# EasyEDA schematic SCH_Robot-car-chihuahua-v1_2024-11-28.json

## Sheets
1 Sheet_1: TITLE: Motor Control Board; REV: 1.0; Date: 2024-11-23; Sheet: 1/1; Drawn By: goobertrooper69; Company: Team NULL
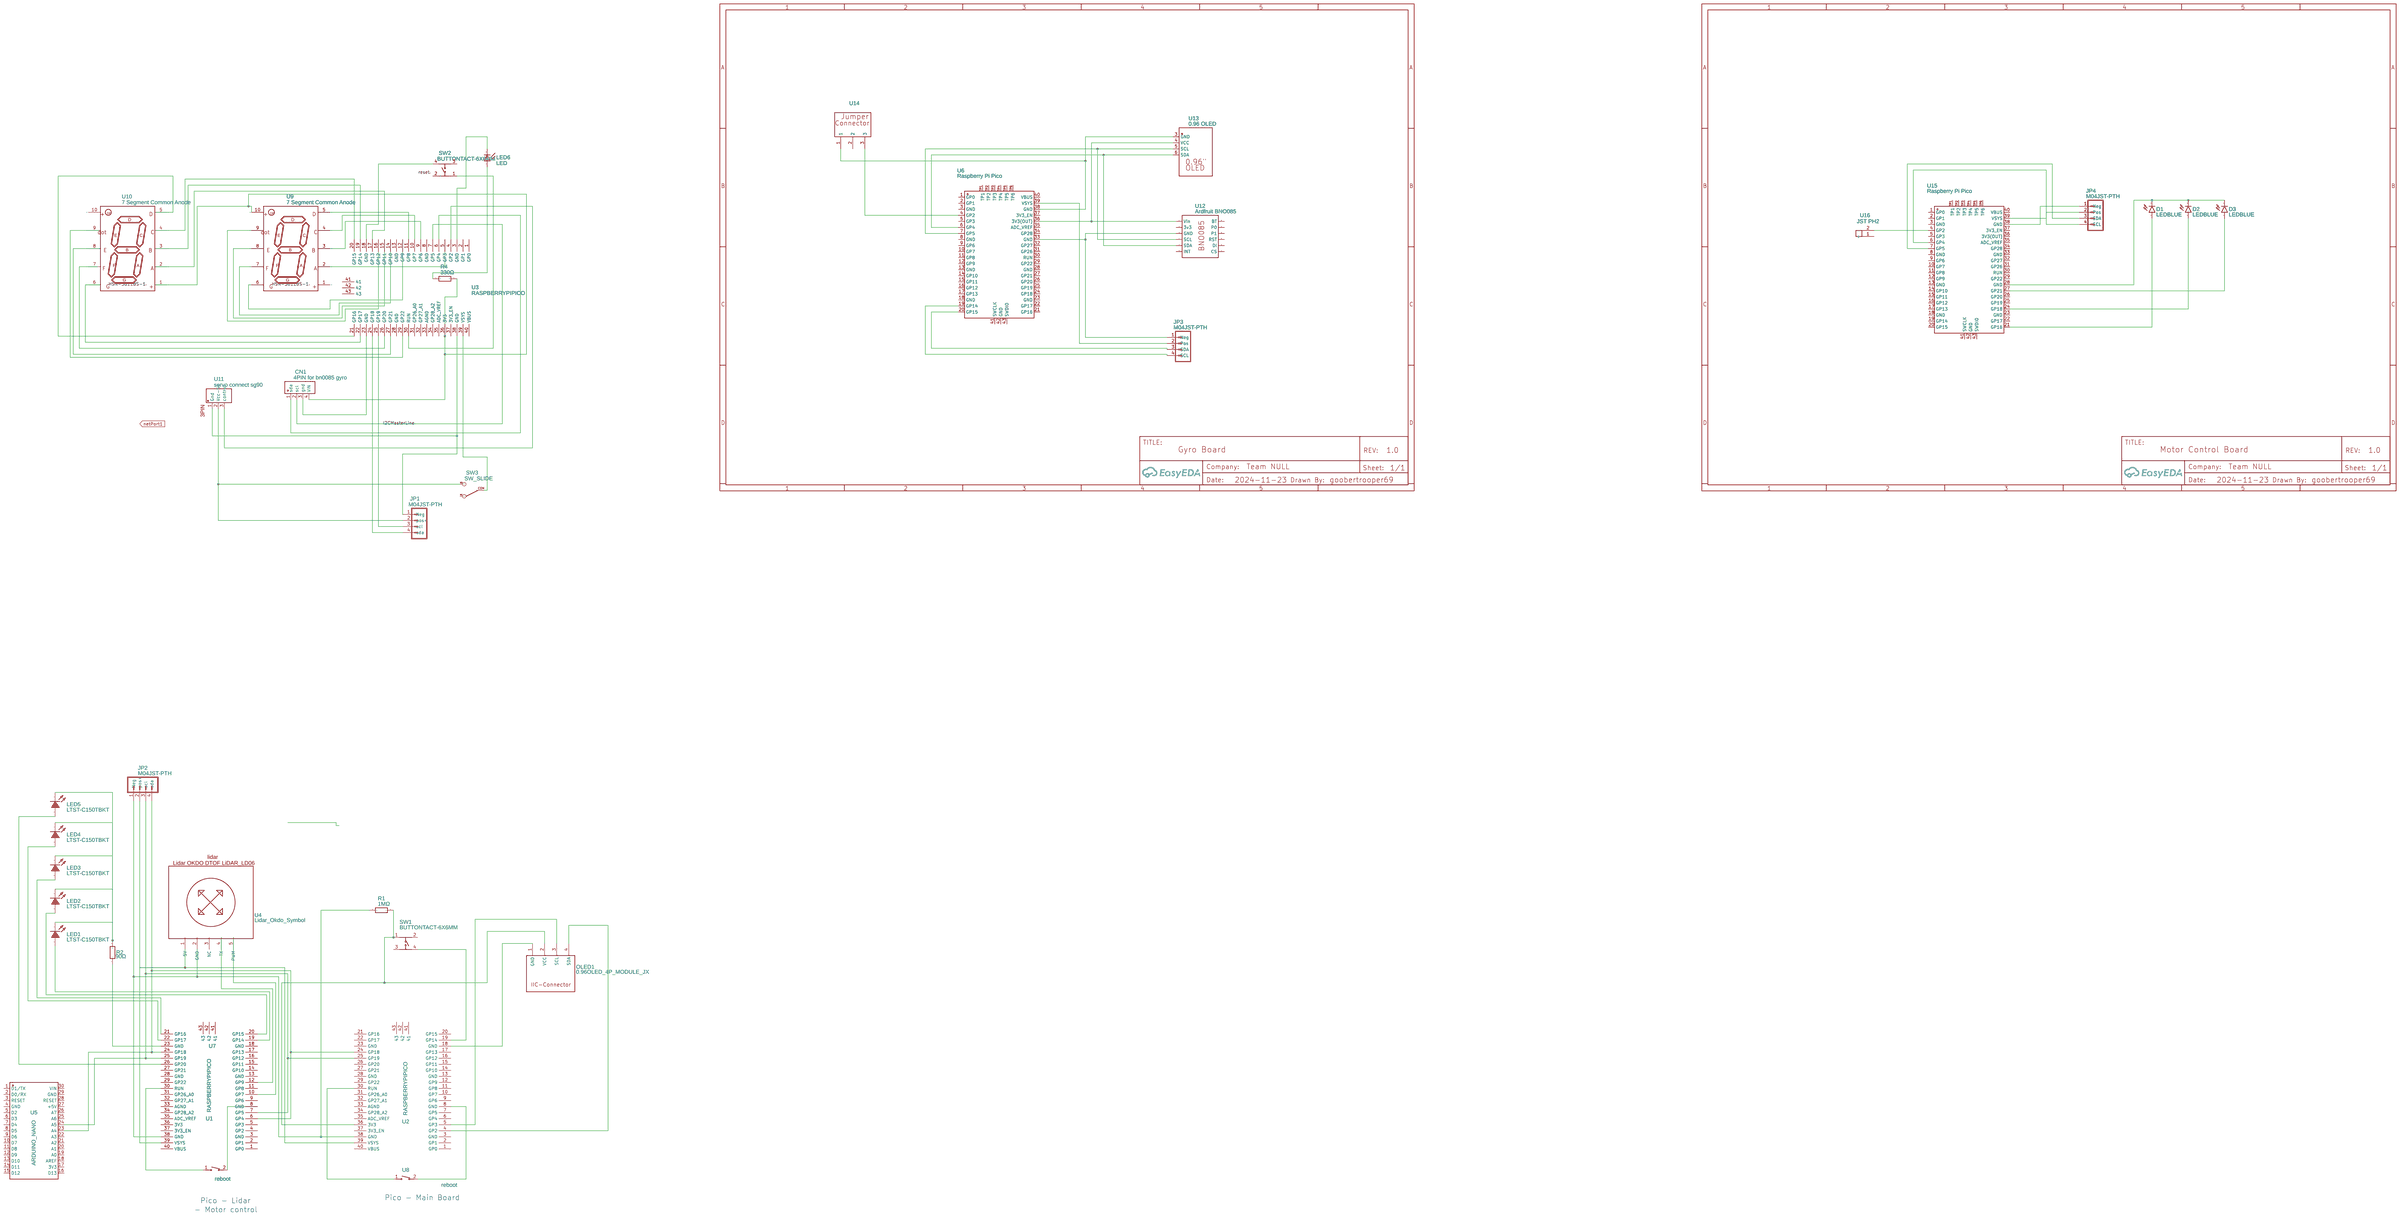
[diagram p0: Sheet_1]
2 Gyro Board: TITLE: Gyro Board; Drawn By: Team NULL
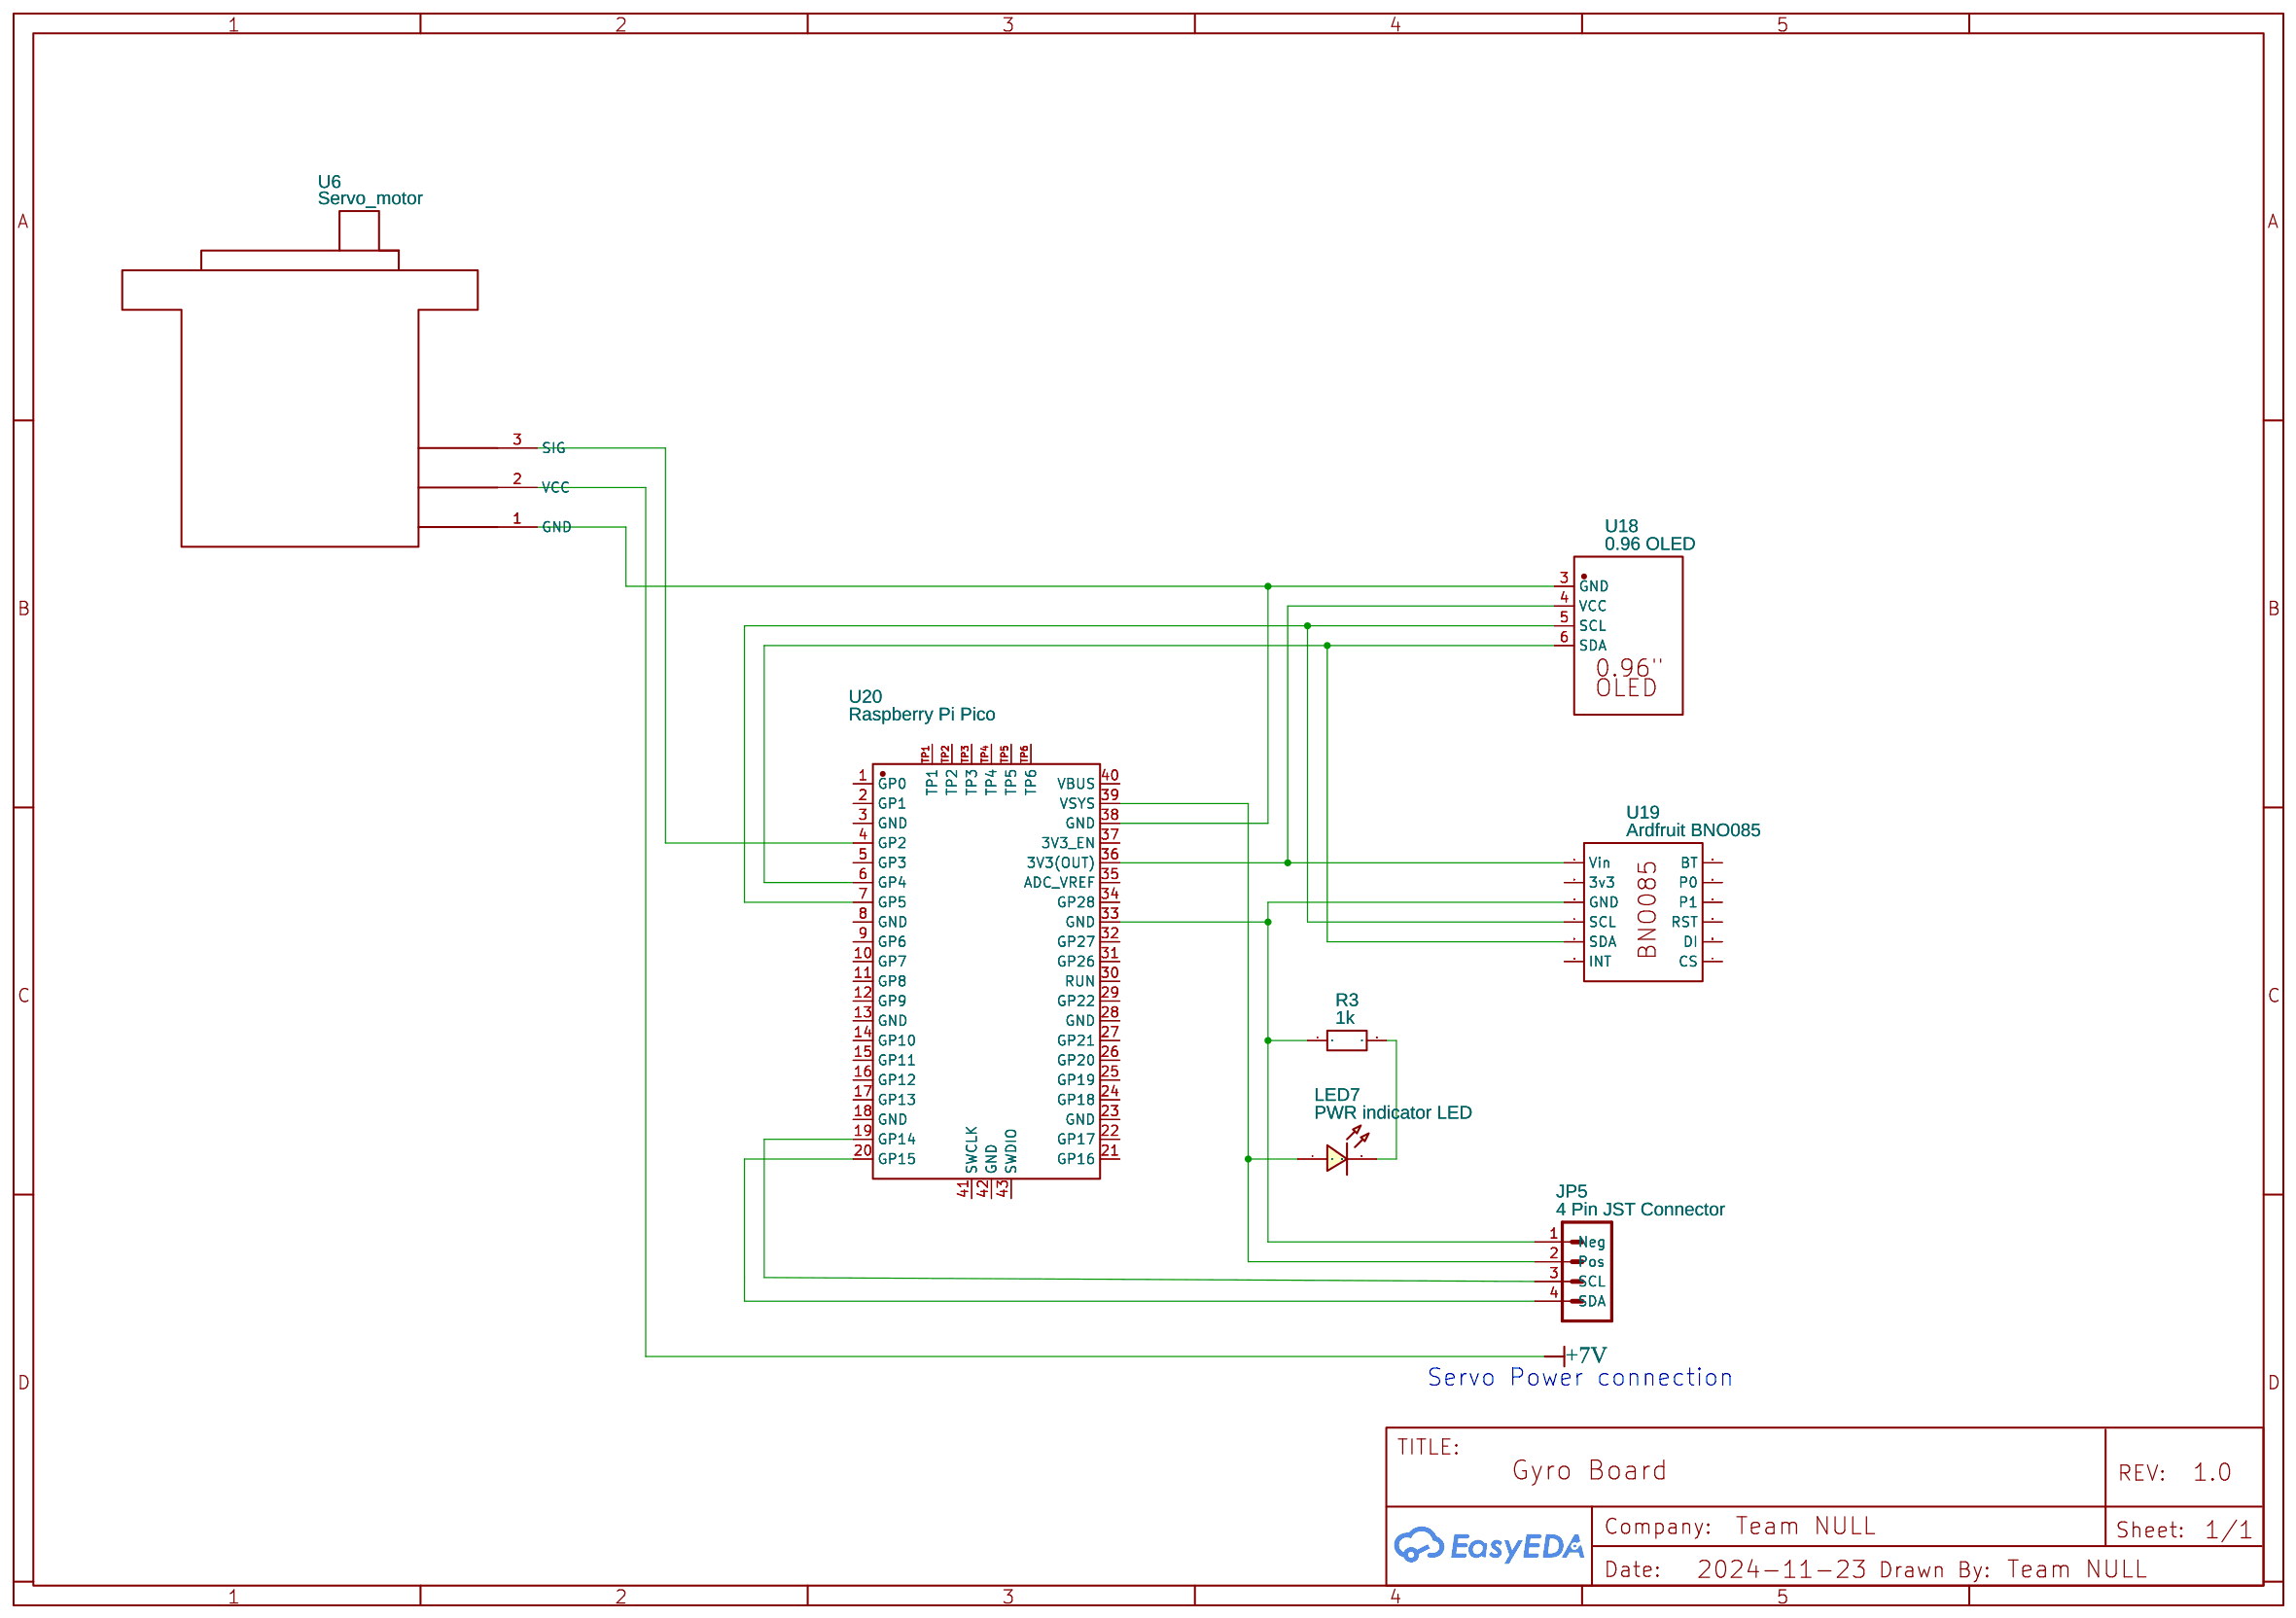
[diagram p1: Gyro Board]
3 Motor Board: TITLE: Motor Board; Drawn By: Team NULL
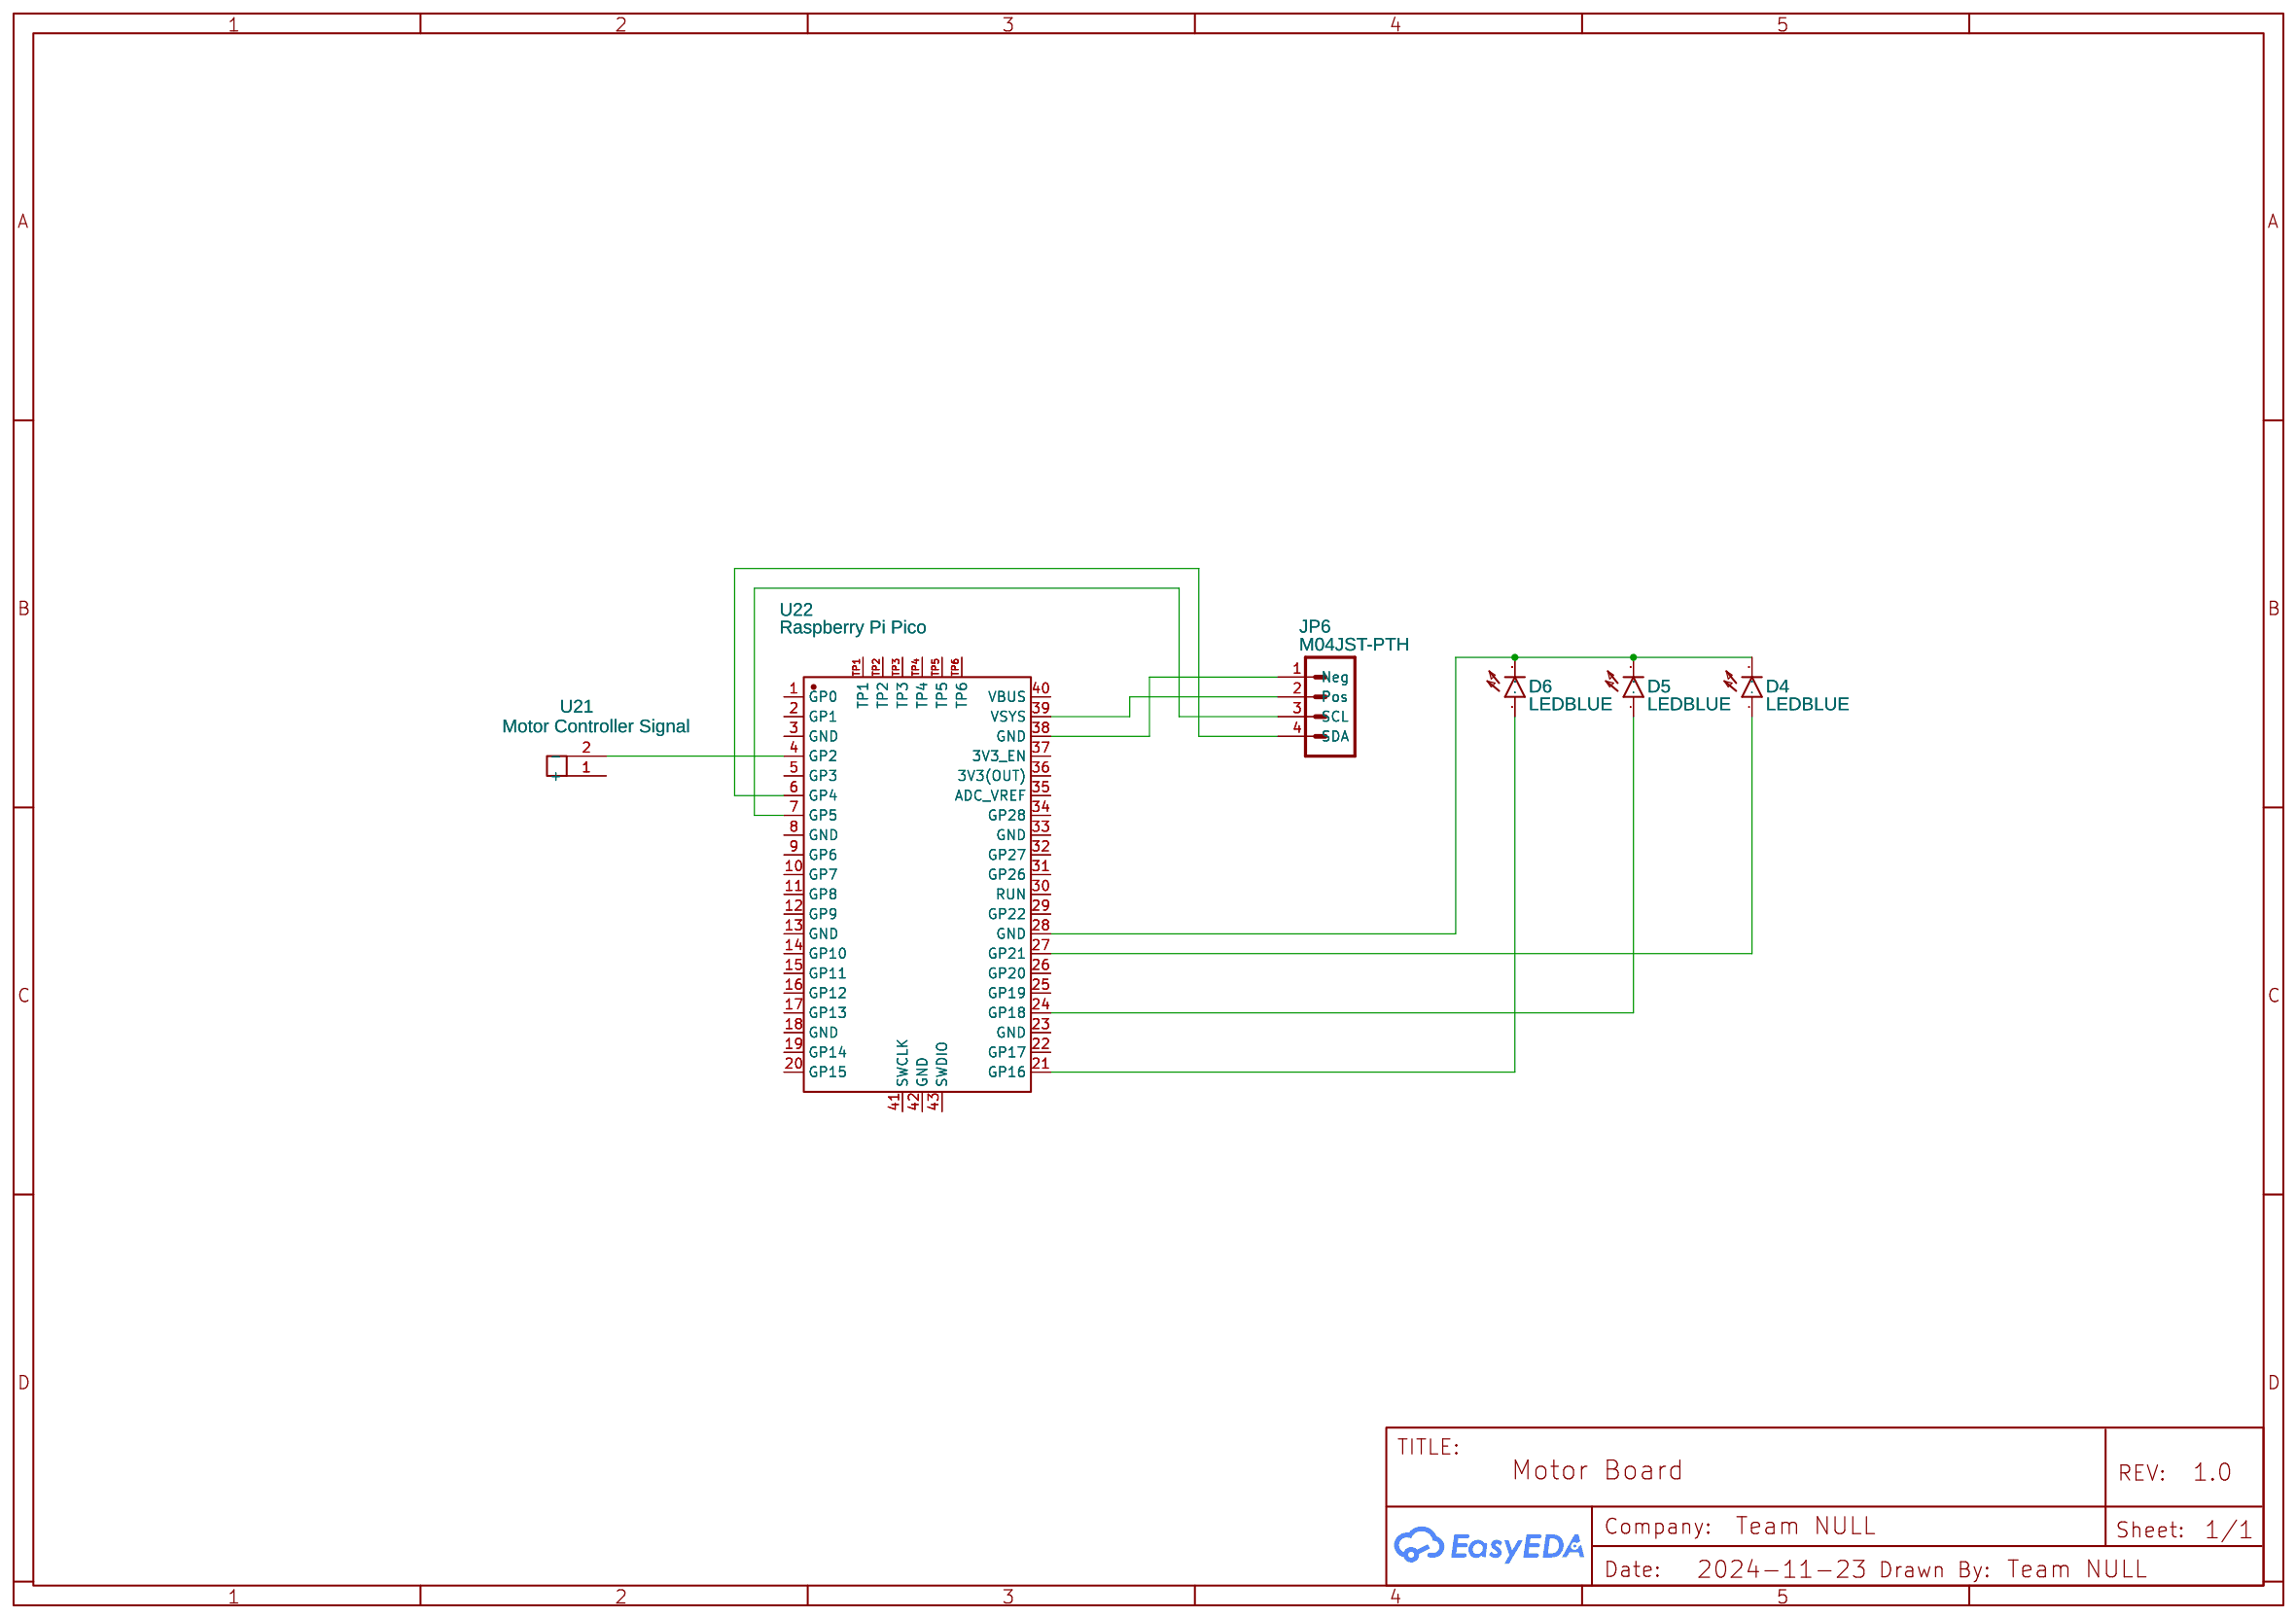
[diagram p2: Motor Board]
4 Main Board: TITLE: Main Board; Drawn By: Team NULL; Company: TEAM NULL
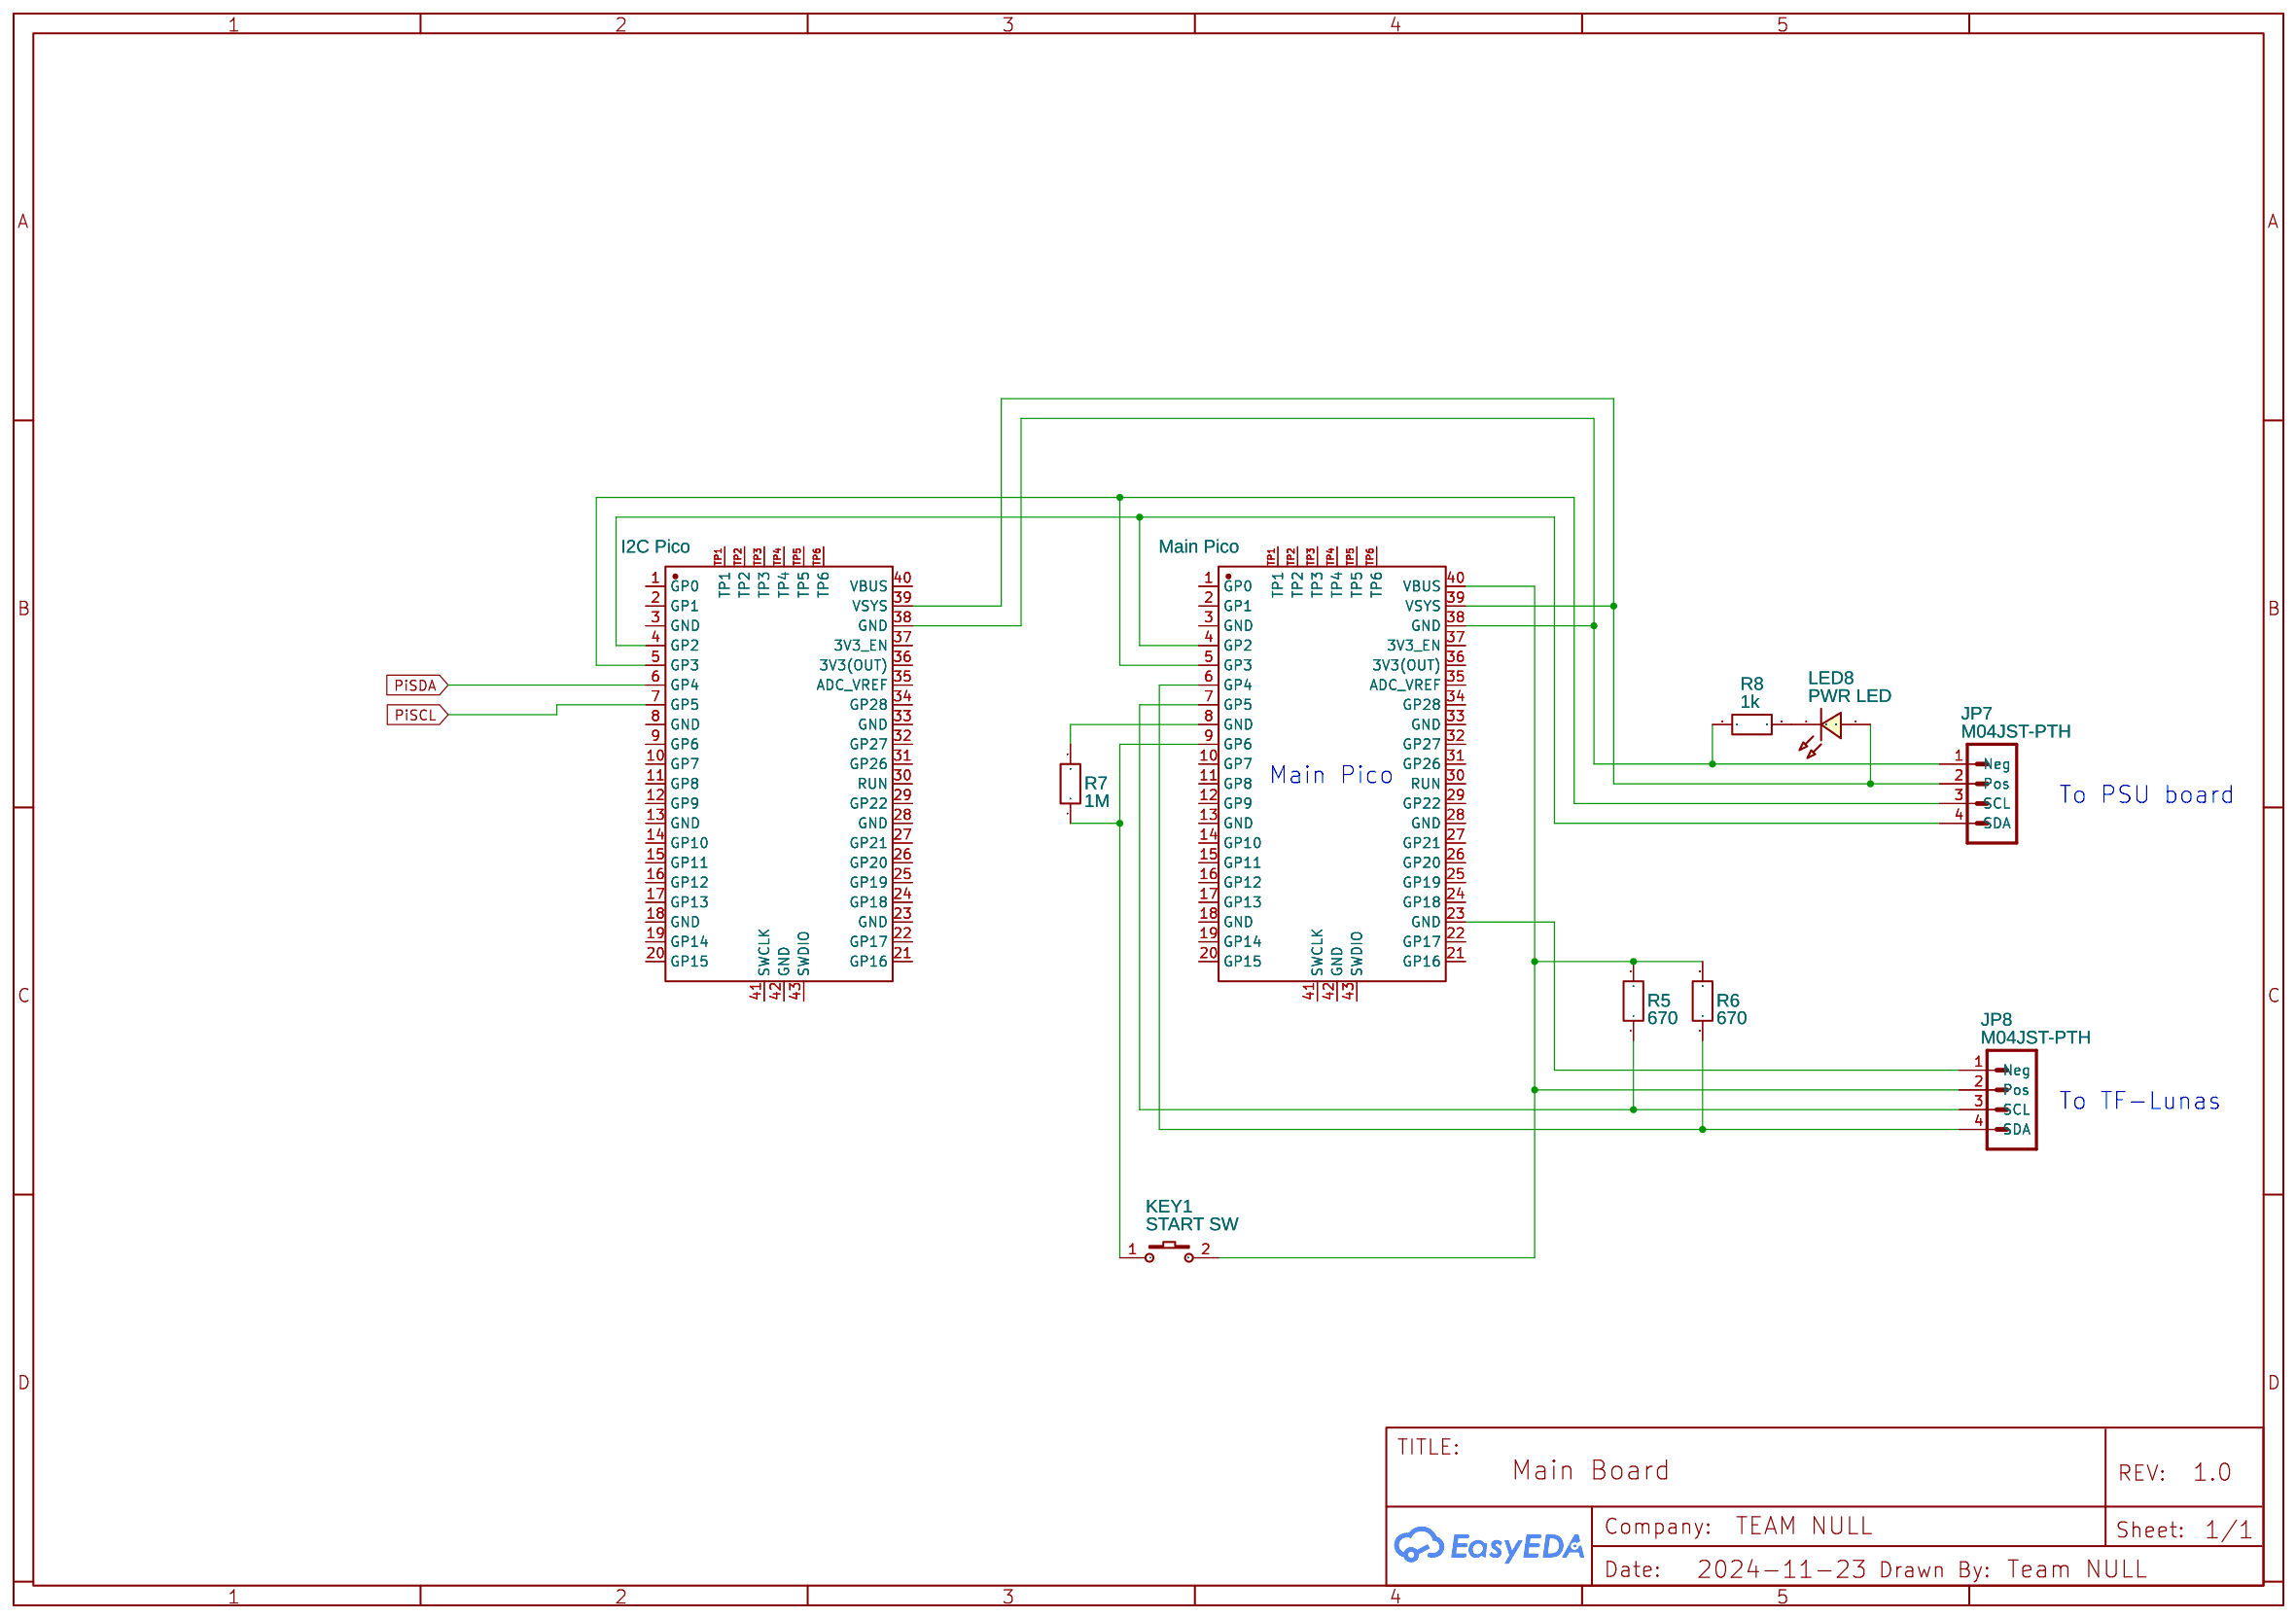
[diagram p3: Main Board]
5 Whole Robot: TITLE: Whole Robot; Date: 2024-11-14; Drawn By: team Null; Company: Team Null
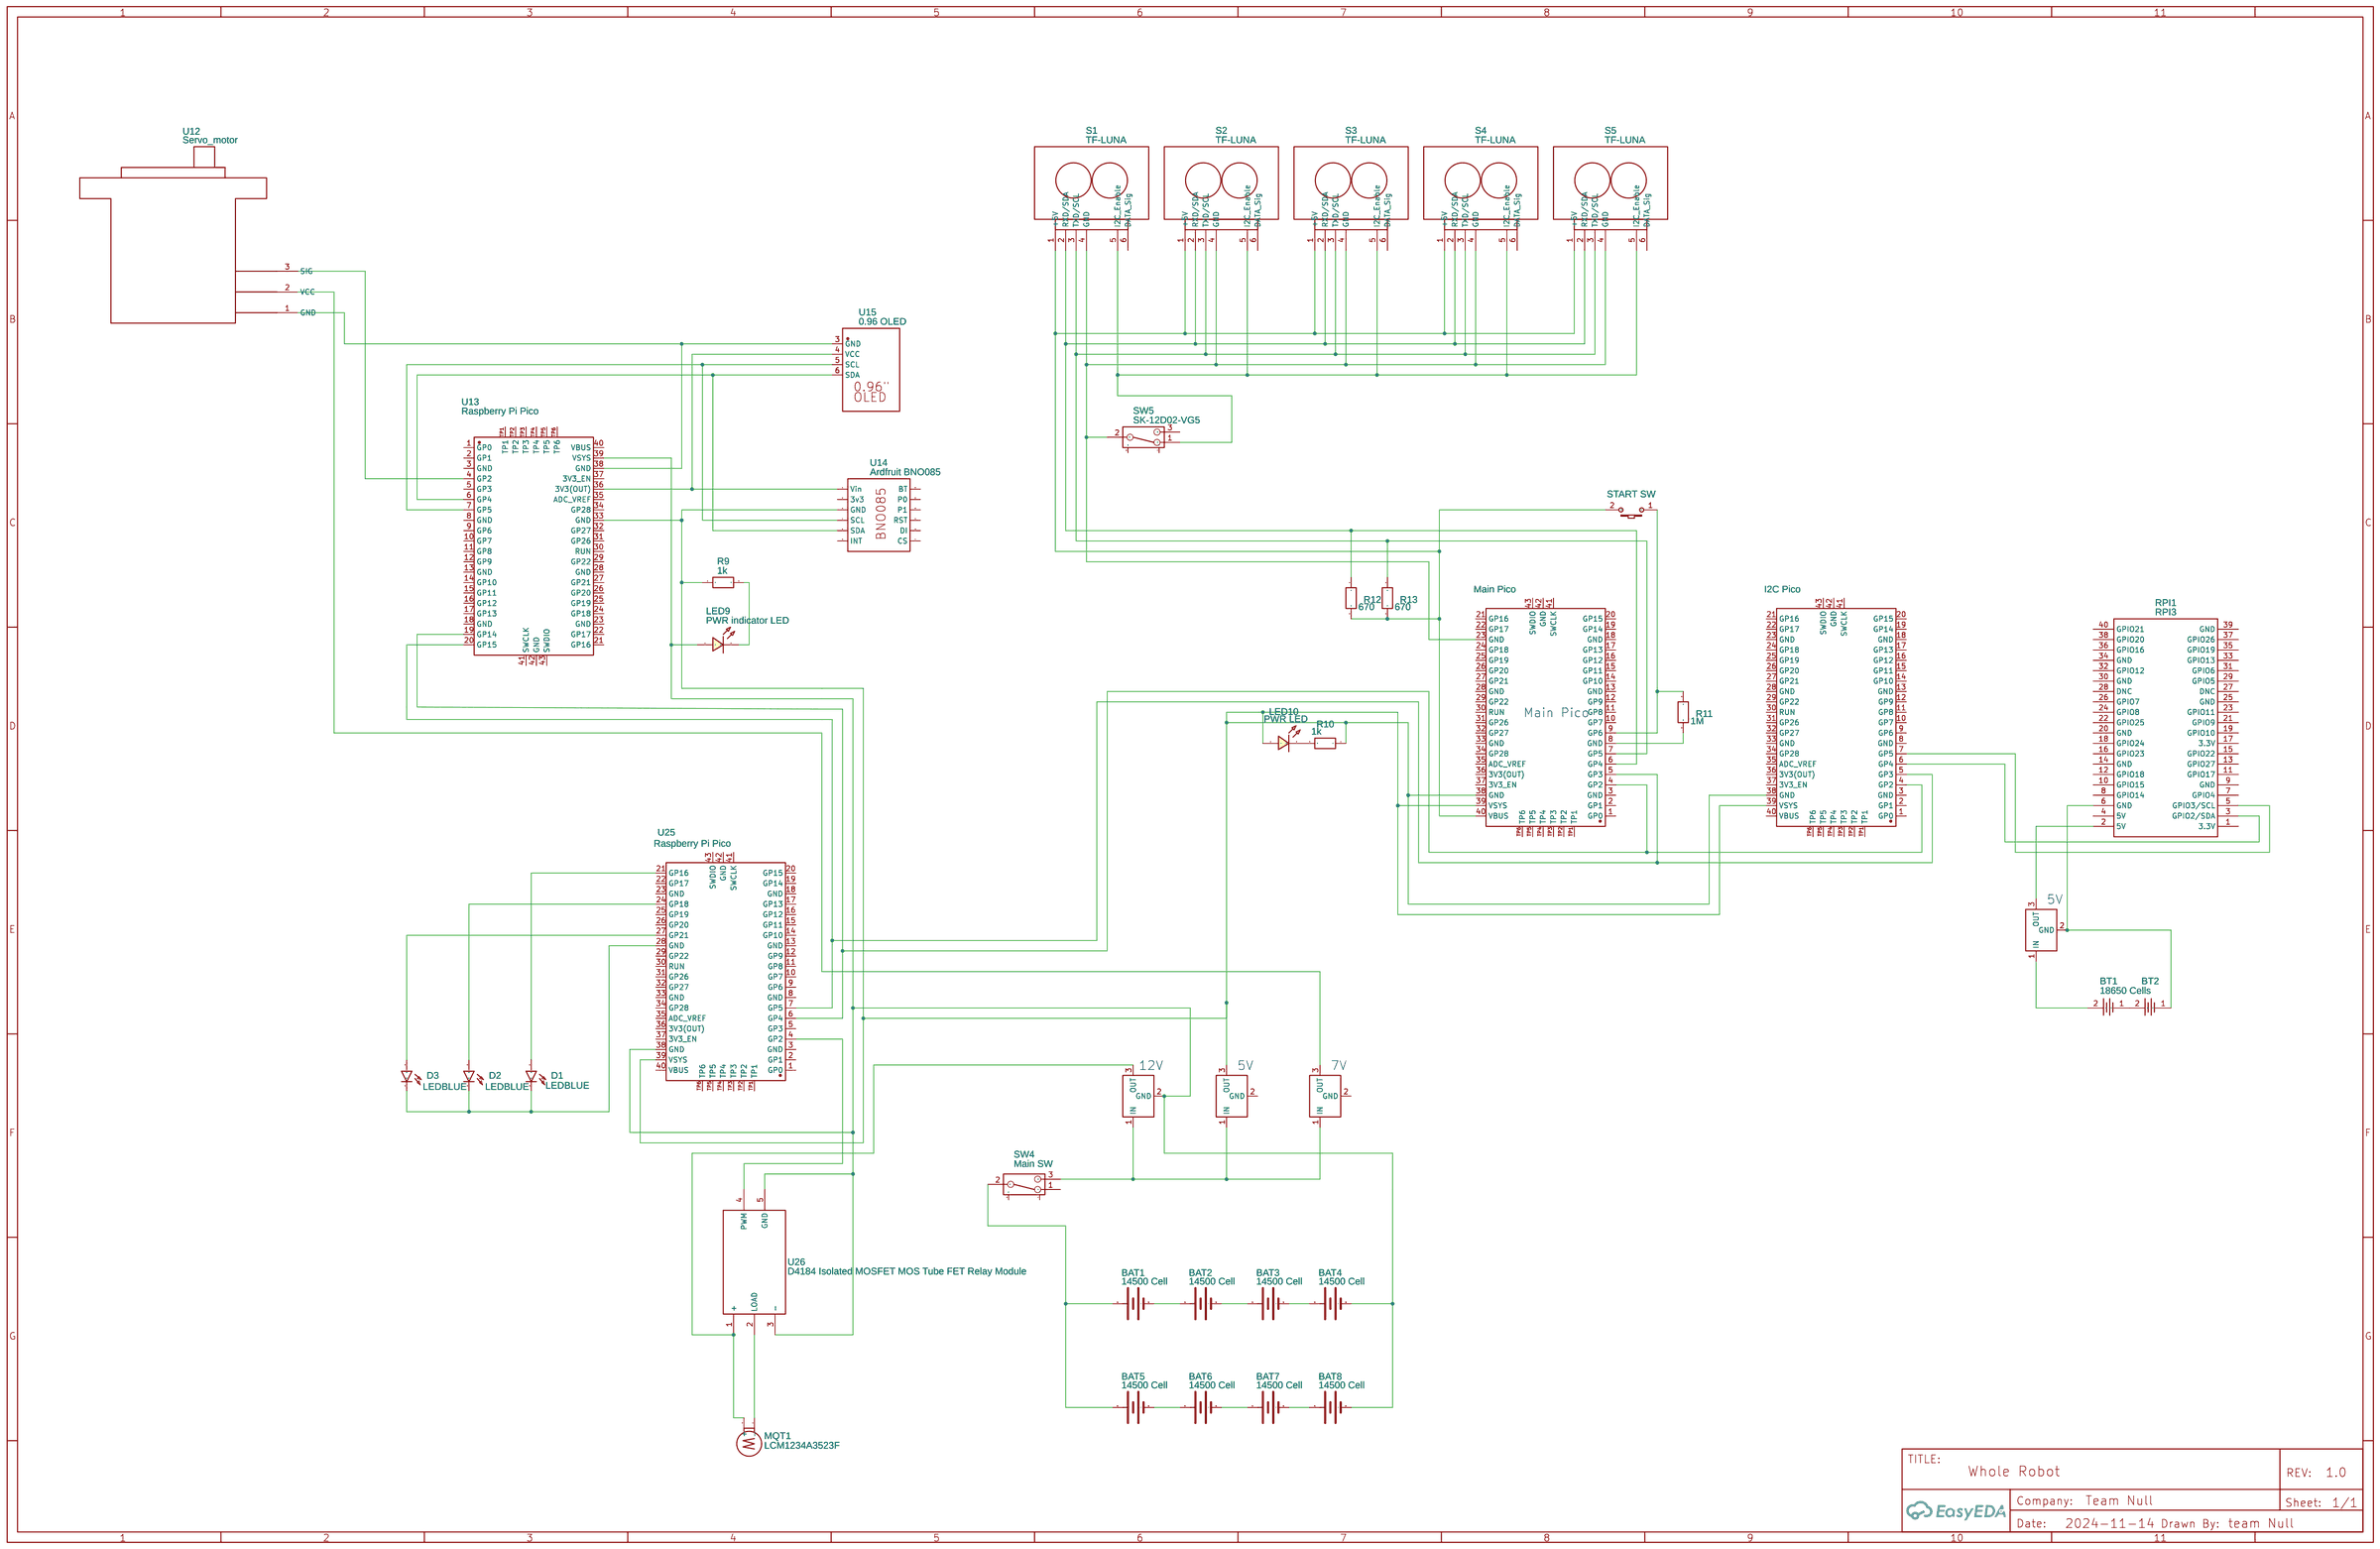
[diagram p4: Whole Robot]

## Parts
sheet Gyro Board
JP5  4 Pin JST Connector  [JST-4-PTH]
LED7  PWR indicator LED  [LED0603_RED]
R3  1k  [R0603]
U6#2  Servo_motor
U18  0.96 OLED  [OLED-TH_OLED0.96-I2C]
U19  Ardfruit BNO085  [ADAFRUIT-BNO085]
U20  Raspberry Pi Pico  [COMM-SMD_L51.0-W21.0-P2.54_SC0916]
sheet Main Board
JP7  M04JST-PTH  [JST-4-PTH]
JP8  M04JST-PTH  [JST-4-PTH]
KEY1  START SW  [KEY-SMD_2P-L6.2-W3.6-LS8.0]
LED8  PWR LED  [LED0603_RED]
R5  670  [R0603]
R6  670  [R0603]
R7  1M  [R0603]
R8  1k  [R0603]
U23  I2C Pico  [COMM-SMD_L51.0-W21.0-P2.54_SC0916]
U24  Main Pico  [COMM-SMD_L51.0-W21.0-P2.54_SC0916]
sheet Motor Board
D4  LEDBLUE  [LEDBLUE]
D5  LEDBLUE  [LEDBLUE]
D6  LEDBLUE  [LEDBLUE]
JP6  M04JST-PTH  [JST-4-PTH]
U21  Motor Controller Signal  [JST-PH-JST-PH2]
U22  Raspberry Pi Pico  [COMM-SMD_L51.0-W21.0-P2.54_SC0916]
sheet Sheet_1
CN1  4PIN for bn0085 gyro  [CONN-TH_4P-P2.50_4PIN]
D1  LEDBLUE  [LEDBLUE]
D2  LEDBLUE  [LEDBLUE]
D3  LEDBLUE  [LEDBLUE]
JP1  M04JST-PTH  [JST-4-PTH]
JP2  M04JST-PTH  [JST-4-PTH]
JP3  M04JST-PTH  [JST-4-PTH]
JP4  M04JST-PTH  [JST-4-PTH]
LED1  LTST-C150TBKT  [LED1206-RD_BLUE]
LED2  LTST-C150TBKT  [LED1206-RD_BLUE]
LED3  LTST-C150TBKT  [LED1206-RD_BLUE]
LED4  LTST-C150TBKT  [LED1206-RD_BLUE]
LED5  LTST-C150TBKT  [LED1206-RD_BLUE]
LED6  LED  [P-LCC-2-TOPLED-RG]
OLED1  0.96OLED_4P_MODULE_JX  [0.96OLED_4P]
R1  1MΩ  [R0805]
R2  90Ω  [R0805]
R4  330Ω  [R0805]
SW1  BUTTONTACT-6X6MM  [SW-SMD_4P-L6.0-W6.0-P4.50-LS9.2]
SW2  BUTTONTACT-6X6MM  [SW-SMD_4P-L6.0-W6.0-P4.50-LS9.2]
SW3  SW_SLIDE  [SLIDE_SWITCH_SMD]
U1  RASPBERRYPIPICO  [RASPBERRYPIPICOTHOMAS]
U2  RASPBERRYPIPICO  [RASPBERRYPIPICOTHOMAS]
U3  RASPBERRYPIPICO  [RASPBERRYPIPICOTHOMAS]
U4  Lidar_Okdo_Symbol  [LIDAR_5P_DUPONT]
U5  ARDUINO_NANO  [COMM-TH_ARDUINO_NANO]
U6  Raspberry Pi Pico  [COMM-SMD_L51.0-W21.0-P2.54_SC0916]
U7  reboot  [KEY-SMD_L6.0-W6.0-LS6.6]
U8  reboot  [KEY-SMD_L6.0-W6.0-LS6.6]
U9  7 Segment Common Anode  [7-SEGMENT-DISPLAY]
U10  7 Segment Common Anode  [7-SEGMENT-DISPLAY]
U11  servo connect sg90  [3PIN]
U12  Ardfruit BNO085  [ADAFRUIT-BNO085]
U13  0.96 OLED  [OLED-TH_OLED0.96-I2C]
U14  JUMPERCONNECTOR_3  [JUMPERCONNECTOR]
U15  Raspberry Pi Pico  [COMM-SMD_L51.0-W21.0-P2.54_SC0916]
U16  JST PH2  [JST-PH-JST-PH2]
sheet Whole Robot
BAT1  14500 Cell  [BATTERY-AA]
BAT2  14500 Cell  [BATTERY-AA]
BAT3  14500 Cell  [BATTERY-AA]
BAT4  14500 Cell  [BATTERY-AA]
BAT5  14500 Cell  [BATTERY-AA]
BAT6  14500 Cell  [BATTERY-AA]
BAT7  14500 Cell  [BATTERY-AA]
BAT8  14500 Cell  [BATTERY-AA]
BT1  18650 Cells  [BAT-TH_BH-18650-A1AJ006]
BT2  BH-18650-A1AJ006  [BAT-TH_BH-18650-A1AJ006]
D1#2  LEDBLUE  [LEDBLUE]
D2#2  LEDBLUE  [LEDBLUE]
D3#2  LEDBLUE  [LEDBLUE]
KEY2  START SW  [KEY-SMD_2P-L6.2-W3.6-LS8.0]
LED9  PWR indicator LED  [LED0603_RED]
LED10  PWR LED  [LED0603_RED]
MQT1  LCM1234A3523F  [VIBRATING-MOTOR-SMD_WELDING]
R9  1k  [R0603]
R10  1k  [R0603]
R11  1M  [R0603]
R12  670  [R0603]
R13  670  [R0603]
RPI1  RPI3  [HDR-20X2/2.54]
S1  TF-LUNA  [TF_LUNA]
S2  TF-LUNA  [TF_LUNA]
S3  TF-LUNA  [TF_LUNA]
S4  TF-LUNA  [TF_LUNA]
S5  TF-LUNA  [TF_LUNA]
SW4  Main SW  [SW-TH_SK-12D02VG3]
SW5  SK-12D02-VG5  [SW-TH_SK-12D02VG3]
U12#2  Servo_motor
U13#2  Raspberry Pi Pico  [COMM-SMD_L51.0-W21.0-P2.54_SC0916]
U14#2  Ardfruit BNO085  [ADAFRUIT-BNO085]
U15#2  0.96 OLED  [OLED-TH_OLED0.96-I2C]
U16#2  Main Pico  [COMM-SMD_L51.0-W21.0-P2.54_SC0916]
U17  I2C Pico  [COMM-SMD_L51.0-W21.0-P2.54_SC0916]
U25  Raspberry Pi Pico  [COMM-SMD_L51.0-W21.0-P2.54_SC0916]
U26  D4184 Isolated MOSFET MOS Tube FET Relay Module  [D4184 ISOLATED MOSFET MOS TUBE FET RELAY MODULE 40V 50A FOR ARDUINO]
U27  VOLTAGEREGULATOR COPY  [VOLTAGEREGULATOR]
U28  VOLTAGEREGULATOR COPY  [VOLTAGEREGULATOR]
U29  VOLTAGEREGULATOR COPY  [VOLTAGEREGULATOR]
U30  VOLTAGEREGULATOR COPY  [VOLTAGEREGULATOR]

## Library data of the parts
JP3-JP8 = M04JST-PTH: Contributor: instantramen; Package Display: No
LED7-LED10 = LED-0603_R: Manufacturer: EVERLIGHT(台湾亿光); Manufacturer Part: 19-217/R6C-AL1M2VY/3T; Supplier Part: C72044; Supplier: LCSC; Contributor: LCEDA_01
R3 R5-R13 = R_0603_EU: Contributor: LCEDA_Lib
U6#2 U12#2 = Servo_motor: Contributor: michael_she
U13 U15#2 U18 = 0.96 OLED: Supplier Part: AZDelivery; Manufacturer: AZDelivery; Manufacturer Part: ZJY096S0700BG01蓝色; link: https://img.jlc.com/pdf/applyPasteComponent/2022-08-15/203417A/337c2d88c1b34c958220578f8c1ccd46/ZJY096S0700WG01.pdf; Contributor: tonydc
U12 U14#2 U19 = Ardfruit BNO085: Manufacturer: Ardfruit; Contributor: Ashok Dhaker; Supplier: Adafruit
U6 U13#2 U15 U16#2 U17 U20 U22-U25 = PICO: Supplier: LCSC; Supplier Part: C7203002; Manufacturer: Raspberry Pi(树莓派); JLCPCB Part Class: Extended Part; Contributor: lcsc
KEY1 KEY2 = K2-3.6×6.1_SMD: Supplier Part: C118141; Supplier: LCSC; Manufacturer Part: K2-1107ST-A4SW-06; Contributor: LCEDA_Lib; 制造商: 韩国韩荣
D1 D1#2 D2 D2#2 D3 D3#2 D4-D6 = LEDBLUE: Contributor: Conrad Ma
U16 U21 = JST PH2: Contributor: pwarrow99
CN1 = 4PIN白色直针插座: Contributor: LCSC; Supplier: LCSC; Supplier Part: C9900004960; JLCPCB Part Class: Extended Part; Manufacturer: null
JP1 JP2 = M04JST-PTH: Header 4; Contributor: SparkFun
LED1-LED5 = LTST-C150TBKT: Contributor: LCSC; Supplier: LCSC; Manufacturer: LITEON(光宝); Supplier Part: C125088; JLCPCB Part Class: Extended Part
LED6 = LED: Contributor: Adafruit
OLED1 = 0.96OLED_4P_MODULE_JX: Contributor: LCSC; Supplier: LCSC; Supplier Part: C9900004566; Manufacturer: null; JLCPCB Part Class: Extended Part
R1 R2 R4 = RS-05K90R0FT: Contributor: LCSC; Supplier: LCSC; Supplier Part: C320576; Manufacturer: FH(风华); JLCPCB Part Class: Extended Part
SW1 SW2 = BUTTONTACT-6X6MM: Contributor: LCSC; Supplier: LCSC; Supplier Part: C9900004221; JLCPCB Part Class: Extended Part
SW3 = SW_SLIDE: Contributor: DangerousPrototype
U1 U2 = RASPBERRYPIPICO: Contributor: thomas255
U3 = RASPBERRYPIPICO: Contributor: thomas255; Package Display: No
U4 = Lidar_Okdo_Symbol: Supplier: Okdo; Contributor: michael_she
U5 = ARDUINO_NANO: Contributor: lcsc; Supplier: LCSC; Supplier Part: C9900017879; Manufacturer: null; JLCPCB Part Class: Extended Part; link: https://lcsc.com/eda_search?q=C9900017879&%26type=1&ref=editor
U7 U8 = BUTTON_C9900040040: Contributor: lcsc; Supplier: LCSC; Supplier Part: C9900040040; Manufacturer: null; JLCPCB Part Class: Extended Part
U9 U10 = 7 Segment Common Anode Display LTS-23805HRB pinout: Contributor: a-luk; Supplier Part: LTS-23805HRB; Manufacturer: Liteon
U11 = 3PIN: Contributor: Bronick
U14 = JUMPERCONNECTOR_3: Contributor: yschluet
BAT1-BAT8 = BATTERYAA: Battery Holders; Contributor: SparkFun
BT1 BT2 = BH-18650-A1AJ006: Supplier: LCSC; Supplier Part: C5290175; Manufacturer: MYOUNG(美阳); Contributor: lcsc; JLCPCB Part Class: Extended Part
MQT1 = LCM1234A3523F: Supplier: LCSC; Supplier Part: C7424783; Manufacturer: LEADER(立得); Contributor: lcsc; JLCPCB Part Class: Extended Part
RPI1 = RPI3: Contributor: Sases; Supplier: Adafruit; Manufacturer: Raspberry Pi; Supplier Part: 3775; Manufacturer Part: Raspberry Pi 3 - Model B+ - 1.4GHz Cortex-A53 with 1GB RAM
S1-S5 = TF-LUNA: Supplier: Benewake; Contributor: sahilrnikam
SW4 SW5 = SK-12D02-VG5: Supplier: LCSC; Supplier Part: C136722; Manufacturer: Rectangular Connectors - Contacts; Contributor: LCSC
U26 = D4184 Isolated MOSFET MOS Tube FET Relay Module: Supplier: Banggood; Contributor: Abhishek Sebastian
U27-U30 = VOLTAGEREGULATOR COPY: Contributor: philipp.maack

## Nets
I2CMasterLine: CN1.2(scl) U3.7(GP5)
PiSCL: U23.7(GP5)
PiSDA: U23.6(GP4)
Net-(BAT1-GND@1): BAT1.GND@1(-) BAT2.PWR@1(+)
Net-(BAT1-PWR@1): BAT1.PWR@1(+) BAT5.PWR@1(+) SW4.2
Net-(BAT2-GND@1): BAT2.GND@1(-) BAT3.PWR@1(+)
Net-(BAT3-GND@1): BAT3.GND@1(-) BAT4.PWR@1(+)
Net-(BAT4-GND@1): BAT4.GND@1(-) BAT8.GND@1(-) LED9.1 U13#2.39(VSYS) U25.38(GND) U26.3(-) U26.5(GND) U27.2(GND)
Net-(BAT5-GND@1): BAT5.GND@1(-) BAT6.PWR@1(+)
Net-(BAT6-GND@1): BAT6.GND@1(-) BAT7.PWR@1(+)
Net-(BAT7-GND@1): BAT7.GND@1(-) BAT8.PWR@1(+)
Net-(BT1-1): BT1.1 BT2.2
Net-(BT1-2): BT1.2 U30.1(IN)
Net-(BT2-1): BT2.1 RPI1.6(GND) U30.2(GND)
Net-(CN1-1): CN1.1(sda) U3.6(GP4)
Net-(CN1-3): CN1.3(gnd) U3.23(GND)
Net-(CN1-4): CN1.4(VIN) R4.2 U3.36(3V3) U10.1
Net-(D1#2-1): D1#2.1(A) U25.21(GP16)
Net-(D1#2-2): D1#2.2(C) D2#2.2(C) D3#2.2(C) U25.28(GND)
Net-(D1-1): D1.1(A) U15.21(GP16)
Net-(D1-2): D1.2(C) D2.2(C) D3.2(C) U15.28(GND)
Net-(D2#2-1): D2#2.1(A) U25.24(GP18)
Net-(D2-1): D2.1(A) U15.24(GP18)
Net-(D3#2-1): D3#2.1(A) U25.27(GP21)
Net-(D3-1): D3.1(A) U15.27(GP21)
Net-(D4-1): D4.1(A) U22.27(GP21)
Net-(D4-2): D4.2(C) D5.2(C) D6.2(C) U22.28(GND)
Net-(D5-1): D5.1(A) U22.24(GP18)
Net-(D6-1): D6.1(A) U22.21(GP16)
Net-(JP1-1): JP1.1(Neg) U3.38(GND) U11.1(Gnd)
Net-(JP1-2): JP1.2(pos+) SW3.NO U11.2(Vcc-5v)
Net-(JP1-3): JP1.3(scl) U3.25(GP19)
Net-(JP1-4): JP1.4(sda) U3.24(GP18)
Net-(JP2-1): JP2.1(Neg) R1.2 U1.38(GND) U2.38(GND)
Net-(JP2-2): JP2.2(pos+) U1.39(VSYS) U2.39(VSYS)
Net-(JP2-3): JP2.3(scl) U1.7(GP5) U1.25(GP19) U2.25(GP19) U5.24(A5)
Net-(JP2-4): JP2.4(sda) U1.6(GP4) U1.24(GP18) U2.24(GP18) U5.23(A4)
Net-(JP3-1): JP3.1(Neg) U6.33(GND) U12.3(GND)
Net-(JP3-2): JP3.2(Pos) U6.39(VSYS)
Net-(JP3-3): JP3.3(SDA) U6.20(GP15)
Net-(JP3-4): JP3.4(SCL) U6.19(GP14)
Net-(JP4-1): JP4.1(Neg) U15.38(GND)
Net-(JP4-2): JP4.2(Pos) U15.39(VSYS)
Net-(JP4-3): JP4.3(SDA) U15.7(GP5)
Net-(JP4-4): JP4.4(SCL) U15.6(GP4)
Net-(JP5-1): JP5.1(Neg) R3.1 U19.3(GND) U20.33(GND)
Net-(JP5-2): JP5.2(Pos) LED7.1 U20.39(VSYS)
Net-(JP5-3): JP5.3(SCL) U20.19(GP14)
Net-(JP5-4): JP5.4(SDA) U20.20(GP15)
Net-(JP6-1): JP6.1(Neg) U22.38(GND)
Net-(JP6-2): JP6.2(Pos) U22.39(VSYS)
Net-(JP6-3): JP6.3(SCL) U22.7(GP5)
Net-(JP6-4): JP6.4(SDA) U22.6(GP4)
Net-(JP7-1): JP7.1(Neg) R8.1 U23.38(GND) U24.38(GND)
Net-(JP7-2): JP7.2(Pos) LED8.1 U23.39(VSYS) U24.39(VSYS)
Net-(JP7-3): JP7.3(SCL) U23.5(GP3) U24.5(GP3)
Net-(JP7-4): JP7.4(SDA) U23.4(GP2) U24.4(GP2)
Net-(JP8-1): JP8.1(Neg) U24.23(GND)
Net-(JP8-2): JP8.2(Pos) KEY1.2 R5.2 R6.2 U24.40(VBUS)
Net-(JP8-3): JP8.3(SCL) R5.1 U24.7(GP5)
Net-(JP8-4): JP8.4(SDA) R6.1 U24.6(GP4)
Net-(KEY1-1): KEY1.1 R7.1 U24.9(GP6)
Net-(KEY2-1): KEY2.1 R11.1 U16#2.9(GP6)
Net-(KEY2-2): KEY2.2 R12.2 R13.2 S1.1(+5V) S2.1(+5V) S3.1(+5V) S4.1(+5V) S5.1(+5V) U16#2.40(VBUS)
Net-(LED1-1): LED1.1(K) LED2.1(K) LED3.1(K) LED4.1(K) LED5.1(K) R2.2
Net-(LED1-2): LED1.2(A) U1.19(GP14)
Net-(LED2-2): LED2.2(A) U1.20(GP15)
Net-(LED3-2): LED3.2(A) U1.21(GP16)
Net-(LED4-2): LED4.2(A) U1.22(GP17)
Net-(LED5-2): LED5.2(A) U1.26(GP20)
Net-(LED6-A): LED6.A R4.1
Net-(LED6-C): LED6.C U3.3(GND)
Net-(LED7-2): LED7.2 R3.2
Net-(LED8-2): LED8.2 R8.2
Net-(LED9-2): LED9.2 R9.2
Net-(LED10-1): LED10.1 R9.1 R10.1 U13#2.33(GND) U14#2.3(GND) U16#2.38(GND) U16#2.39(VSYS) U17.38(GND) U17.39(VSYS) U25.39(VSYS) U28.3(OUT)
Net-(LED10-2): LED10.2 R10.2
Net-(MQT1-1): MQT1.1(-) U26.2(LOAD)
Net-(MQT1-2): MQT1.2(+) U26.1(+) U27.3(OUT)
Net-(OLED1-1): OLED1.1(GND) U2.18(GND)
Net-(OLED1-2): OLED1.2(VCC) R1.1 SW1.1(A) U2.36(3V3)
Net-(OLED1-3): OLED1.3(SCL) U2.5(GP3)
Net-(OLED1-4): OLED1.4(SDA) U2.4(GP2)
Net-(R2-1): R2.1 U1.23(GND)
Net-(R7-2): R7.2 U24.8(GND)
Net-(R11-2): R11.2 U16#2.8(GND)
Net-(R12-1): R12.1 S1.2(RXD/SDA) S2.2(RXD/SDA) S3.2(RXD/SDA) S4.2(RXD/SDA) S5.2(RXD/SDA) U16#2.6(GP4)
Net-(R13-1): R13.1 S1.3(TXD/SCL) S2.3(TXD/SCL) S3.3(TXD/SCL) S4.3(TXD/SCL) S5.3(TXD/SCL) U16#2.7(GP5)
Net-(RPI1-2): RPI1.2(5V) U30.3(OUT)
Net-(RPI1-3): RPI1.3(GPIO2/SDA) U17.6(GP4)
Net-(RPI1-5): RPI1.5(GPIO3/SCL) U17.7(GP5)
Net-(S1-4): S1.4(GND) S2.4(GND) S3.4(GND) S4.4(GND) S5.4(GND) SW5.2 U16#2.23(GND)
Net-(S1-5): S1.5(I2C Enable) S2.5(I2C Enable) S3.5(I2C Enable) S4.5(I2C Enable) S5.5(I2C Enable) SW5.1
Net-(SW1-4): SW1.4(D) U2.19(GP14)
Net-(SW2-1): SW2.1(A) U3.30(RUN)
Net-(SW2-4): SW2.4(D) U3.18(GND)
Net-(SW3-COM): SW3.COM U3.39(VSYS)
Net-(SW4-3): SW4.3 U27.1(IN) U28.1(IN) U29.1(IN)
Net-(U1-8): U1.8(GND) U7.2(B)
Net-(U1-10): U1.10(GP7) U4.5(PWM)
Net-(U1-12): U1.12(GP9) U4.4(TX)
Net-(U1-30): U1.30(RUN) U7.1(A)
Net-(U2-8): U2.8(GND) U8.2(B)
Net-(U2-30): U2.30(RUN) U8.1(A)
Net-(U3-4): U3.4(GP2) U11.3(control)
Net-(U3-5): U3.5(GP3) U9.2
Net-(U3-9): U3.9(GP6) U9.3
Net-(U3-10): U3.10(GP7) U9.4
Net-(U3-11): U3.11(GP8) U9.5
Net-(U3-12): U3.12(GP9) U9.6
Net-(U3-14): U3.14(GP10) U9.7
Net-(U3-15): U3.15(GP11) U9.8
Net-(U3-16): U3.16(GP12) U9.9
Net-(U3-17): U3.17(GP13) U10.2
Net-(U3-19): U3.19(GP14) U10.3
Net-(U3-20): U3.20(GP15) U10.4
Net-(U3-21): U3.21(GP16) U10.5
Net-(U3-22): U3.22(GP17) U10.6
Net-(U3-27): U3.27(GP21) U10.8
Net-(U3-29): U3.29(GP22) U10.9
Net-(U6-4): U6.4(GP2) U14.3
Net-(U6-6): U6.6(GP4) U12.5(SDA) U13.6(SDA)
Net-(U6-7): U6.7(GP5) U12.4(SCL) U13.5(SCL)
Net-(U6-36): U6.36(3V3(OUT)) U12.1(Vin) U13.4(VCC)
Net-(U6-38): U6.38(GND) U13.3(GND) U14.1
Net-(U13#2-6): U13#2.6(GP4) U14#2.5(SDA) U15#2.6(SDA)
Net-(U13#2-7): U13#2.7(GP5) U14#2.4(SCL) U15#2.5(SCL)
Net-(U13#2-19): U13#2.19(GP14) U16#2.4(GP2) U17.4(GP2) U25.6(GP4)
Net-(U13#2-20): U13#2.20(GP15) U16#2.5(GP3) U17.5(GP3) U25.7(GP5)
Net-(U13#2-36): U13#2.36(3V3(OUT)) U14#2.1(Vin) U15#2.4(VCC)
Net-(U13#2-38): U13#2.38(GND) U15#2.3(GND)
Net-(U15-4): U15.4(GP2) U16.2(-)
Net-(U18-3): U18.3(GND) U20.38(GND)
Net-(U18-4): U18.4(VCC) U19.1(Vin) U20.36(3V3(OUT))
Net-(U18-5): U18.5(SCL) U19.4(SCL) U20.7(GP5)
Net-(U18-6): U18.6(SDA) U19.5(SDA) U20.6(GP4)
Net-(U21-2): U21.2(-) U22.4(GP2)
Net-(U25-4): U25.4(GP2) U26.4(PWM)

Not connected (* = marked no-connect by the designer): RPI1 1(3.3V) 4(5V) 7(GPIO4) 8(GPIO14) 9(GND) 10(GPIO15) 11(GPIO17) 12(GPIO18) 13(GPIO27) 14(GND) 15(GPIO22) 16(GPIO23) 17(3.3V) 18(GPIO24) 19(GPIO10) 20(GND) 21(GPIO9) 22(GPIO25) 23(GPIO11) 24(GPIO8) 25(GND) 26(GPIO7) 27(DNC) 28(DNC) 29(GPIO5) 30(GND) 31(GPIO6) 32(GPIO12) 33(GPIO13) 34(GND) 35(GPIO19) 36(GPIO16) 37(GPIO26) 38(GPIO20) 39(GND) 40(GPIO21); S1 6(DATA Sig); S2 6(DATA Sig); S3 6(DATA Sig); S4 6(DATA Sig); S5 6(DATA Sig); SW1 2(B) 3(C); SW2 2(B) 3(C); SW3 NC; SW4 1 4 5; SW5 3 4 5; U1 1(GP0) 2(GP1) 3(GND) 4(GP2) 5(GP3) 9(GP6) 11(GP8) 13(GND) 14(GP10) 15(GP11) 16(GP12) 17(GP13) 18(GND) 27(GP21) 28(GND) 29(GP22) 31(GP26_A0) 32(GP27_A1) 33(AGND) 34(GP28_A2) 35(ADC_VREF) 36(3V3) 37(3V3_EN) 40(VBUS) 41 42 43; U2 1(GP0) 2(GP1) 3(GND) 6(GP4) 7(GP5) 9(GP6) 10(GP7) 11(GP8) 12(GP9) 13(GND) 14(GP10) 15(GP11) 16(GP12) 17(GP13) 20(GP15) 21(GP16) 22(GP17) 23(GND) 26(GP20) 27(GP21) 28(GND) 29(GP22) 31(GP26_A0) 32(GP27_A1) 33(AGND) 34(GP28_A2) 35(ADC_VREF) 37(3V3_EN) 40(VBUS) 41 42 43; U3 1(GP0) 2(GP1) 8(GND) 13(GND) 26(GP20) 28(GND) 31(GP26_A0) 32(GP27_A1) 33(AGND) 34(GP28_A2) 35(ADC_VREF) 37(3V3_EN) 40(VBUS) 41 42 43; U4 1(5V) 2(GND) 3(NC); U5 1(D1/TX) 2(D0/RX) 3(RESET) 4(GND) 5(D2) 6(D3) 7(D4) 8(D5) 9(D6) 10(D7) 11(D8) 12(D9) 13(D10) 14(D11) 15(D12) 16(D13) 17(3V3) 18(AREF) 19(A0) 20(A1) 21(A2) 22(A3) 25(A6) 26(A7) 27(+5V) 28(RESET) 29(GND) 30(VIN); U6 1(GP0) 2(GP1) 3(GND) 5(GP3) 8(GND) 9(GP6) 10(GP7) 11(GP8) 12(GP9) 13(GND) 14(GP10) 15(GP11) 16(GP12) 17(GP13) 18(GND) 21(GP16) 22(GP17) 23(GND) 24(GP18) 25(GP19) 26(GP20) 27(GP21) 28(GND) 29(GP22) 30(RUN) 31(GP26) 32(GP27) 34(GP28) 35(ADC_VREF) 37(3V3_EN) 40(VBUS) 41(SWCLK) 42(GND) 43(SWDIO) TP1 TP2 TP3 TP4 TP5 TP6; U6#2 1(GND) 2(VCC) 3(SIG); U9 1 10; U10 7 10; U12 2(3v3) 6(INT) 7(CS) 8(DI) 9(RST) 10(P1) 11(P0) 12(BT); U12#2 1(GND) 2(VCC) 3(SIG); U13#2 1(GP0) 2(GP1) 3(GND) 4(GP2) 5(GP3) 8(GND) 9(GP6) 10(GP7) 11(GP8) 12(GP9) 13(GND) 14(GP10) 15(GP11) 16(GP12) 17(GP13) 18(GND) 21(GP16) 22(GP17) 23(GND) 24(GP18) 25(GP19) 26(GP20) 27(GP21) 28(GND) 29(GP22) 30(RUN) 31(GP26) 32(GP27) 34(GP28) 35(ADC_VREF) 37(3V3_EN) 40(VBUS) 41(SWCLK) 42(GND) 43(SWDIO) TP1 TP2 TP3 TP4 TP5 TP6; U14 2; U14#2 2(3v3) 6(INT) 7(CS) 8(DI) 9(RST) 10(P1) 11(P0) 12(BT); U15 1(GP0) 2(GP1) 3(GND) 5(GP3) 8(GND) 9(GP6) 10(GP7) 11(GP8) 12(GP9) 13(GND) 14(GP10) 15(GP11) 16(GP12) 17(GP13) 18(GND) 19(GP14) 20(GP15) 22(GP17) 23(GND) 25(GP19) 26(GP20) 29(GP22) 30(RUN) 31(GP26) 32(GP27) 33(GND) 34(GP28) 35(ADC_VREF) 36(3V3(OUT)) 37(3V3_EN) 40(VBUS) 41(SWCLK) 42(GND) 43(SWDIO) TP1 TP2 TP3 TP4 TP5 TP6; U16 1(+); U16#2 1(GP0) 2(GP1) 3(GND) 10(GP7) 11(GP8) 12(GP9) 13(GND) 14(GP10) 15(GP11) 16(GP12) 17(GP13) 18(GND) 19(GP14) 20(GP15) 21(GP16) 22(GP17) 24(GP18) 25(GP19) 26(GP20) 27(GP21) 28(GND) 29(GP22) 30(RUN) 31(GP26) 32(GP27) 33(GND) 34(GP28) 35(ADC_VREF) 36(3V3(OUT)) 37(3V3_EN) 41(SWCLK) 42(GND) 43(SWDIO) TP1 TP2 TP3 TP4 TP5 TP6; U17 1(GP0) 2(GP1) 3(GND) 8(GND) 9(GP6) 10(GP7) 11(GP8) 12(GP9) 13(GND) 14(GP10) 15(GP11) 16(GP12) 17(GP13) 18(GND) 19(GP14) 20(GP15) 21(GP16) 22(GP17) 23(GND) 24(GP18) 25(GP19) 26(GP20) 27(GP21) 28(GND) 29(GP22) 30(RUN) 31(GP26) 32(GP27) 33(GND) 34(GP28) 35(ADC_VREF) 36(3V3(OUT)) 37(3V3_EN) 40(VBUS) 41(SWCLK) 42(GND) 43(SWDIO) TP1 TP2 TP3 TP4 TP5 TP6; U19 2(3v3) 6(INT) 7(CS) 8(DI) 9(RST) 10(P1) 11(P0) 12(BT); U20 1(GP0) 2(GP1) 3(GND) 4(GP2) 5(GP3) 8(GND) 9(GP6) 10(GP7) 11(GP8) 12(GP9) 13(GND) 14(GP10) 15(GP11) 16(GP12) 17(GP13) 18(GND) 21(GP16) 22(GP17) 23(GND) 24(GP18) 25(GP19) 26(GP20) 27(GP21) 28(GND) 29(GP22) 30(RUN) 31(GP26) 32(GP27) 34(GP28) 35(ADC_VREF) 37(3V3_EN) 40(VBUS) 41(SWCLK) 42(GND) 43(SWDIO) TP1 TP2 TP3 TP4 TP5 TP6; U21 1(+); U22 1(GP0) 2(GP1) 3(GND) 5(GP3) 8(GND) 9(GP6) 10(GP7) 11(GP8) 12(GP9) 13(GND) 14(GP10) 15(GP11) 16(GP12) 17(GP13) 18(GND) 19(GP14) 20(GP15) 22(GP17) 23(GND) 25(GP19) 26(GP20) 29(GP22) 30(RUN) 31(GP26) 32(GP27) 33(GND) 34(GP28) 35(ADC_VREF) 36(3V3(OUT)) 37(3V3_EN) 40(VBUS) 41(SWCLK) 42(GND) 43(SWDIO) TP1 TP2 TP3 TP4 TP5 TP6; U23 1(GP0) 2(GP1) 3(GND) 8(GND) 9(GP6) 10(GP7) 11(GP8) 12(GP9) 13(GND) 14(GP10) 15(GP11) 16(GP12) 17(GP13) 18(GND) 19(GP14) 20(GP15) 21(GP16) 22(GP17) 23(GND) 24(GP18) 25(GP19) 26(GP20) 27(GP21) 28(GND) 29(GP22) 30(RUN) 31(GP26) 32(GP27) 33(GND) 34(GP28) 35(ADC_VREF) 36(3V3(OUT)) 37(3V3_EN) 40(VBUS) 41(SWCLK) 42(GND) 43(SWDIO) TP1 TP2 TP3 TP4 TP5 TP6; U24 1(GP0) 2(GP1) 3(GND) 10(GP7) 11(GP8) 12(GP9) 13(GND) 14(GP10) 15(GP11) 16(GP12) 17(GP13) 18(GND) 19(GP14) 20(GP15) 21(GP16) 22(GP17) 24(GP18) 25(GP19) 26(GP20) 27(GP21) 28(GND) 29(GP22) 30(RUN) 31(GP26) 32(GP27) 33(GND) 34(GP28) 35(ADC_VREF) 36(3V3(OUT)) 37(3V3_EN) 41(SWCLK) 42(GND) 43(SWDIO) TP1 TP2 TP3 TP4 TP5 TP6; U25 1(GP0) 2(GP1) 3(GND) 5(GP3) 8(GND) 9(GP6) 10(GP7) 11(GP8) 12(GP9) 13(GND) 14(GP10) 15(GP11) 16(GP12) 17(GP13) 18(GND) 19(GP14) 20(GP15) 22(GP17) 23(GND) 25(GP19) 26(GP20) 29(GP22) 30(RUN) 31(GP26) 32(GP27) 33(GND) 34(GP28) 35(ADC_VREF) 36(3V3(OUT)) 37(3V3_EN) 40(VBUS) 41(SWCLK) 42(GND) 43(SWDIO) TP1 TP2 TP3 TP4 TP5 TP6; U28 2(GND); U29 2(GND) 3(OUT)

## Notes on the sheets
sheet 1
- Pico - Lidar
- Pico - Main Board
- - Motor control
sheet 2
- Servo Power connection
sheet 4
- Main Pico
- To PSU board
- To TF-Lunas
sheet 5
- Main Pico
- 5V
- 12V
- 5V
- 7V
